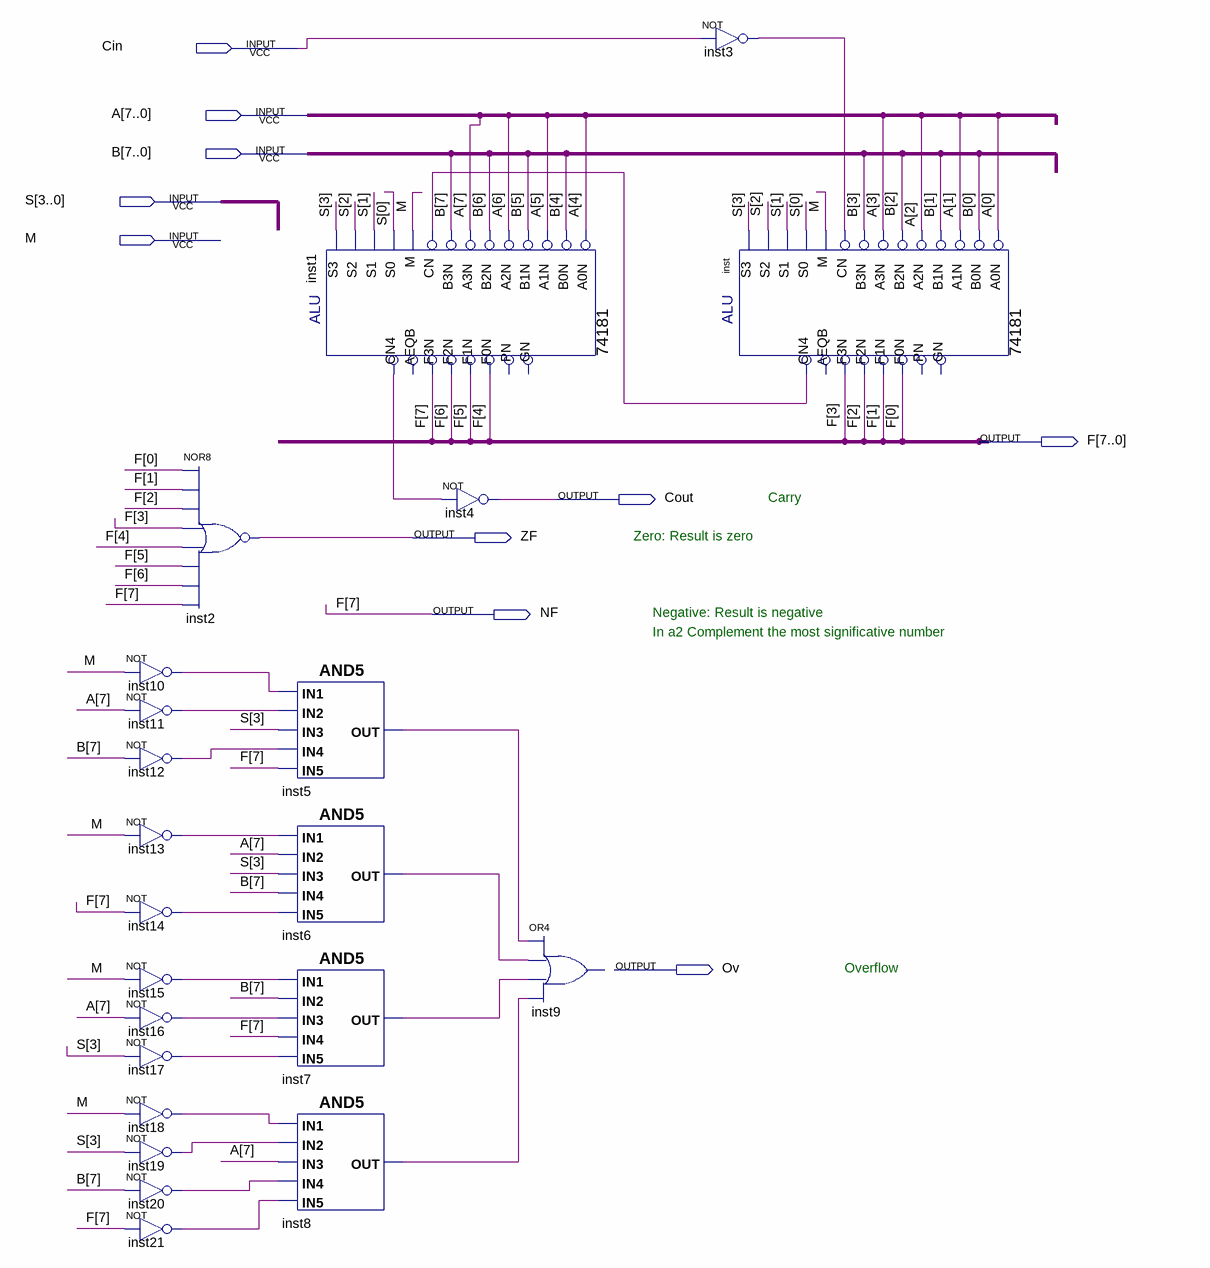
[diagram p0: schematic sheet]
// Quartus schematic Alu8bits.bdf as structural Verilog: 22 symbols, 10 pins
module Alu8bits (
  input  Cin,
  input  [7:0] A,
  input  [7:0] B,
  input  [3:0] S,
  input  M,
  output [7:0] F,
  output Cout,
  output ZF,
  output NF,
  output Ov
);

  wire inst1_cn4, inst3_out, inst5_out, inst6_out, inst7_out, inst8_out, inst10_out, inst11_out, inst12_out,
       inst13_out, inst14_out, inst15_out, inst16_out, inst17_out, inst18_out, inst19_out, inst20_out,
       inst21_out, inst_cn4;

  not inst10 (inst10_out, M);
  not inst11 (inst11_out, A[7]);
  not inst12 (inst12_out, B[7]);
  not inst13 (inst13_out, M);
  not inst14 (inst14_out, F[7]);
  not inst15 (inst15_out, M);
  not inst16 (inst16_out, A[7]);
  not inst17 (inst17_out, S[3]);
  not inst18 (inst18_out, M);
  not inst19 (inst19_out, S[3]);
  not inst20 (inst20_out, B[7]);
  not inst21 (inst21_out, F[7]);
  nor inst2 (ZF, F[0], F[1], F[2], F[3], F[4], F[5], F[6], F[7]);
  and inst5 (inst5_out, inst10_out, inst11_out, S[3], inst12_out, F[7]);
  and inst6 (inst6_out, inst13_out, A[7], S[3], B[7], inst14_out);
  and inst7 (inst7_out, inst15_out, B[7], inst16_out, F[7], inst17_out);
  and inst8 (inst8_out, inst18_out, inst19_out, A[7], inst20_out, inst21_out);
  \74181  inst1 (
    .B0N(B[4]), .A0N(A[4]), .A1N(A[5]), .B1N(B[5]), .A3N(A[7]), .B2N(B[6]), .A2N(A[6]), .M(M), .CN(inst_cn4),
    .B3N(B[7]), .S2(S[2]), .S1(S[1]), .S0(S[0]), .S3(S[3]), .F3N(F[7]), .F1N(F[5]), .F0N(F[4]),
    .CN4(inst1_cn4), .F2N(F[6]));  // open: PN, GN, AEQB
  not inst4 (Cout, inst1_cn4);
  // OR4 inst9 has open pins: IN1=inst5_out, IN2=inst6_out, IN3=inst7_out, IN4=inst8_out, OUT=open
  not inst3 (inst3_out, Cin);
  \74181  inst (
    .B0N(B[0]), .A0N(A[0]), .A1N(A[1]), .B1N(B[1]), .A3N(A[3]), .B2N(B[2]), .A2N(A[2]), .M(M),
    .CN(inst3_out), .B3N(B[3]), .S2(S[2]), .S1(S[1]), .S0(S[0]), .S3(S[3]), .F3N(F[3]), .F1N(F[1]),
    .F0N(F[0]), .CN4(inst_cn4), .F2N(F[2]));  // open: PN, GN, AEQB

  assign NF = F[7];

  // Notes on the sheet:
  //   Carry
  //   Zero: Result is zero
  //   Negative: Result is negative
  //   In a2 Complement the most significative number
  //   Overflow
endmodule
